# Altium schematic sheet BBoard-JX2.SchDoc: Eval Board -  BBoard JX1 connector (PWM, GPIO)
size A3; Author: O. Guinnard; Organization: imperix Ltd; Address1: Rue de l'Industrie 10; Address2: 1950 Sion; Address3: Switzerland; Address4: +41 27 552 06 60; DocumentNumber: 5; SheetNumber: 5; SheetTotal: 7
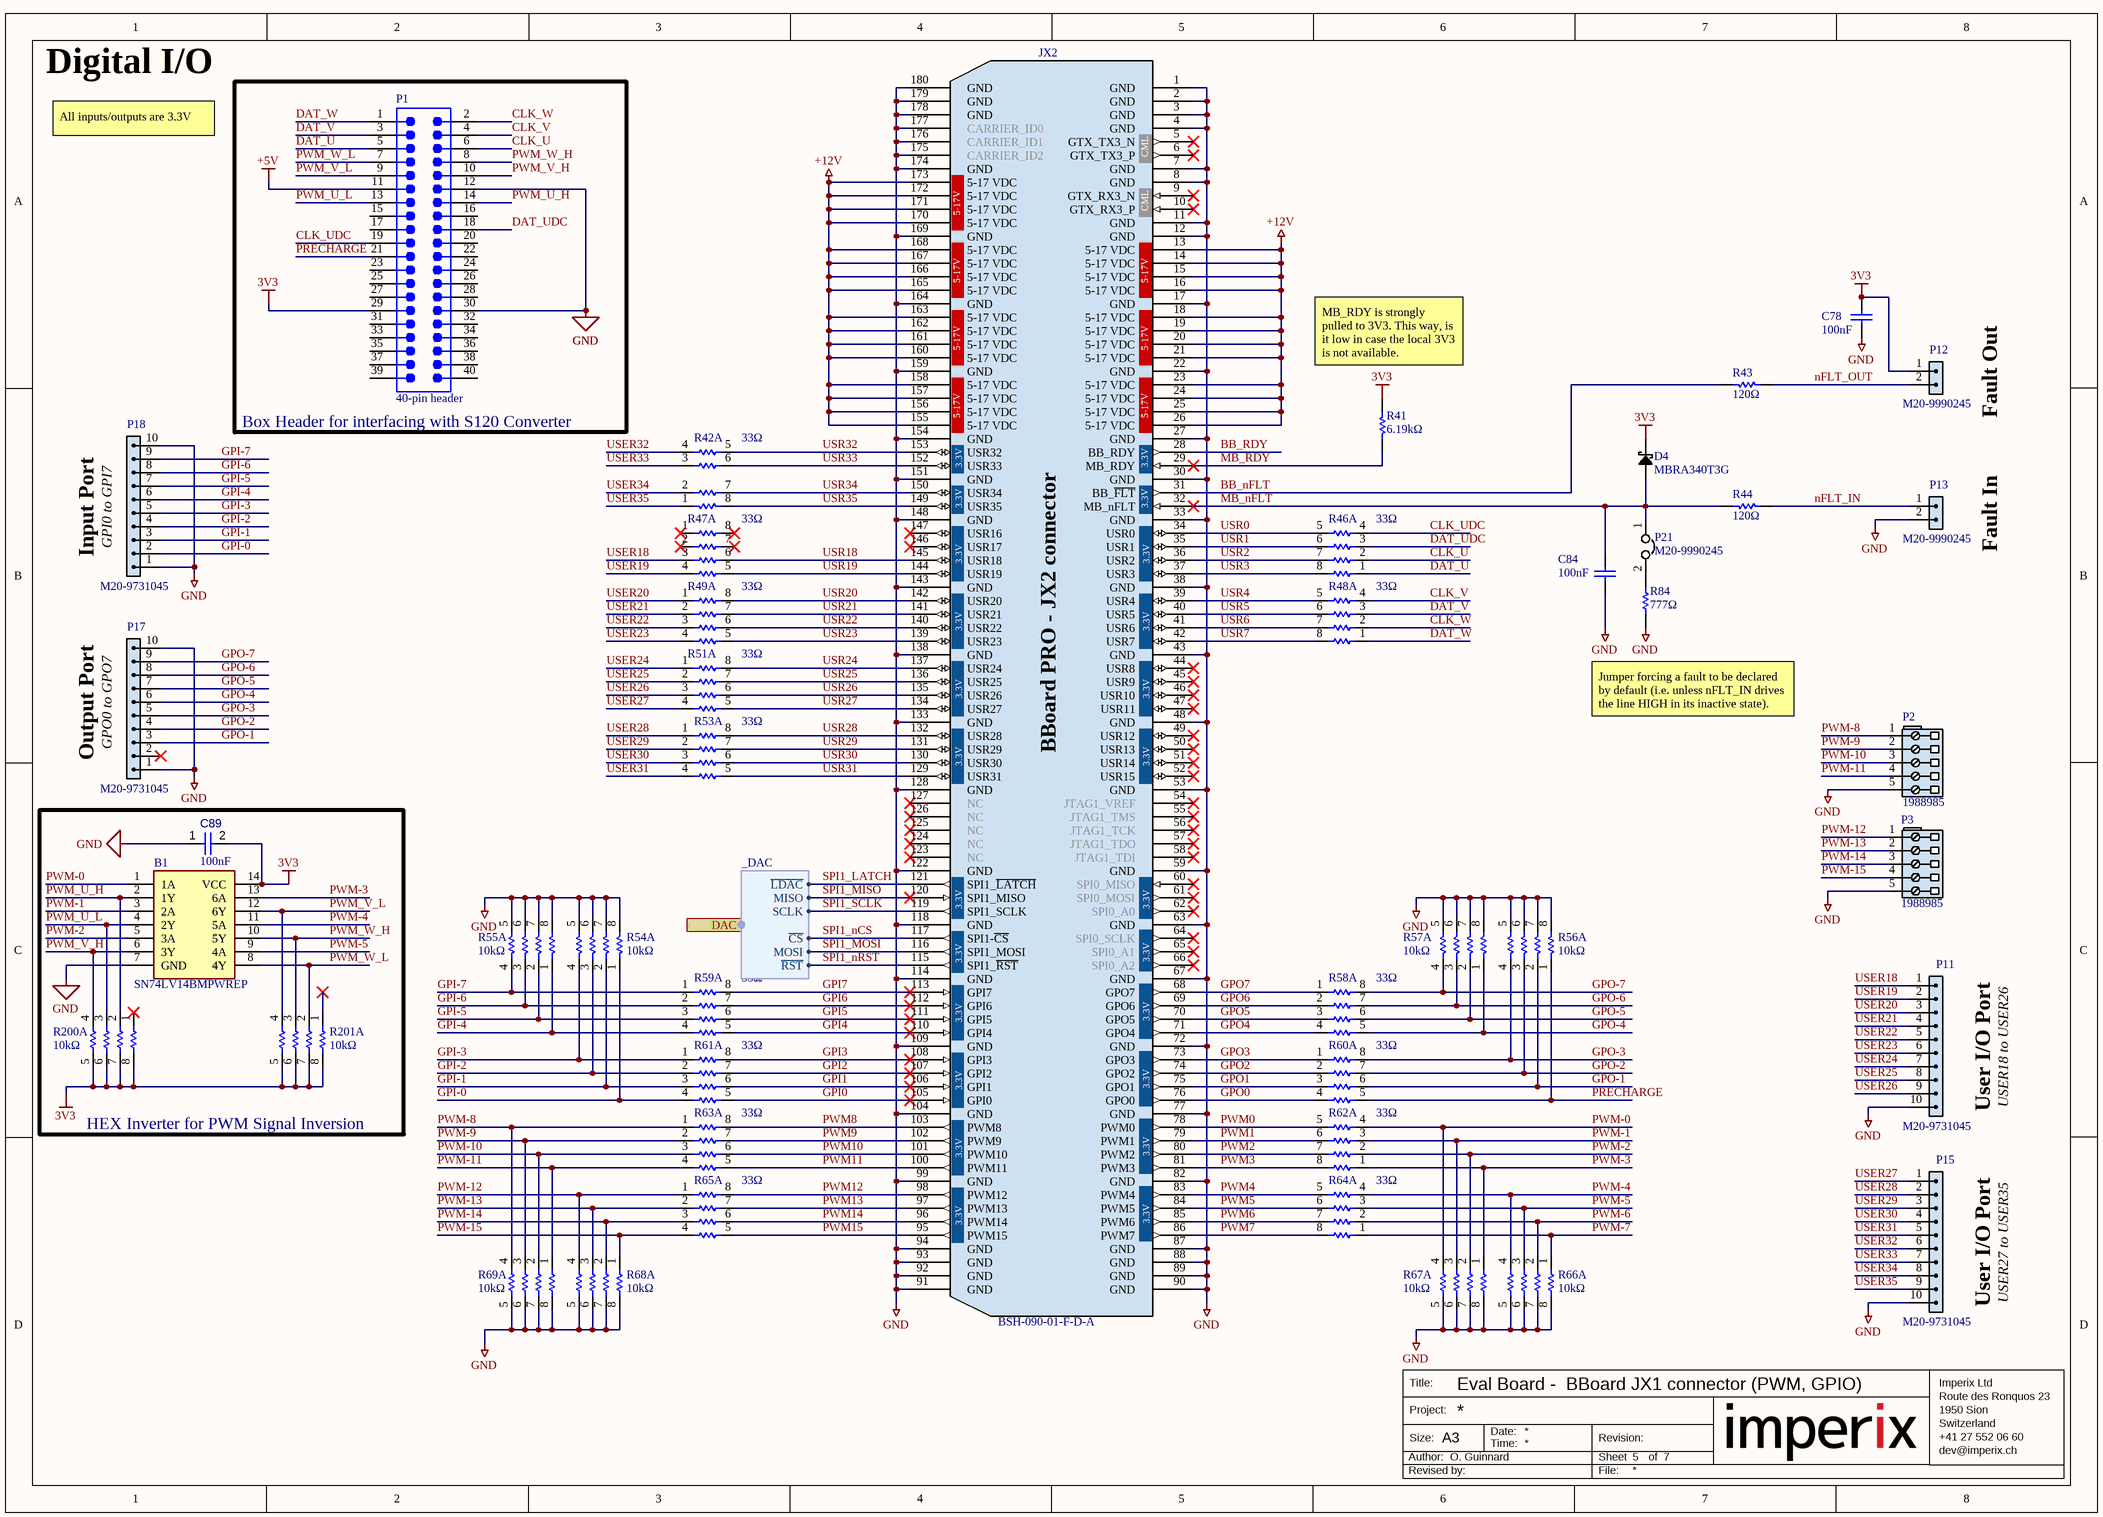
[diagram p0: BBoard-JX2.SchDoc]

## Parts
B1  SN74LV14BMPWREP  [SOP65P640X120-14N]
C78  value 100nF  [CAPC1005L(0402)]  (hidden comment: CAP-100NF-25V-X7R-0402-10%)
C84  value 100nF  [CAPC1005L(0402)]  (hidden comment: CAP-100NF-25V-X7R-0402-10%)
C89  value 100nF  [CAPC0402(1005)60_L]  (hidden comment: Capacitor 100nF +/-20% 50V 0402)
D4  MBRA340T3G  [DO-214AC]
JX2  BSH-090-01-F-D-A  [BSH-090-01-F-D-A]
P1  40-pin header  [61204021621]
P2  1988985  [1988985]
P3  1988985  [1988985]
P11  M20-9731045  [M20-9731045]
P12  M20-9990245  [M20-9990245]
P13  M20-9990245  [M20-9990245]
P15  M20-9731045  [M20-9731045]
P17  M20-9731045  [M20-9731045]
P18  M20-9731045  [M20-9731045]
P21  M20-9990245  [M20-9990245]
R41  value 6.19kΩ  [RESC1005L(0402)]  (hidden comment: RES-6.19KΩ-1/16W-100PPM-0402-1%)
R42  value 33Ω  [RESQUAD0804]  (hidden comment: EXB-28V330JX)  (parts A,B,C,D of 4)
R43  value 120Ω  [RESC1005L(0402)]  (hidden comment: RES-120Ω-1/16W-25PPM-0402-0.1%)
R44  value 120Ω  [RESC1005L(0402)]  (hidden comment: RES-120Ω-1/16W-25PPM-0402-0.1%)
R46  value 33Ω  [RESQUAD0804]  (hidden comment: EXB-28V330JX)  (parts A,B,C,D of 4)
R47  value 33Ω  [RESQUAD0804]  (hidden comment: EXB-28V330JX)  (parts A,B,C,D of 4)
R48  value 33Ω  [RESQUAD0804]  (hidden comment: EXB-28V330JX)  (parts A,B,C,D of 4)
R49  value 33Ω  [RESQUAD0804]  (hidden comment: EXB-28V330JX)  (parts A,B,C,D of 4)
R51  value 33Ω  [RESQUAD0804]  (hidden comment: EXB-28V330JX)  (parts A,B,C,D of 4)
R53  value 33Ω  [RESQUAD0804]  (hidden comment: EXB-28V330JX)  (parts A,B,C,D of 4)
R54  value 10kΩ  [RESQUAD0804]  (hidden comment: EXB-28V103JX)  (parts A,B,C,D of 4)
R55  value 10kΩ  [RESQUAD0804]  (hidden comment: EXB-28V103JX)  (parts A,B,C,D of 4)
R56  value 10kΩ  [RESQUAD0804]  (hidden comment: EXB-28V103JX)  (parts A,B,C,D of 4)
R57  value 10kΩ  [RESQUAD0804]  (hidden comment: EXB-28V103JX)  (parts A,B,C,D of 4)
R58  value 33Ω  [RESQUAD0804]  (hidden comment: EXB-28V330JX)  (parts A,B,C,D of 4)
R59  value 33Ω  [RESQUAD0804]  (hidden comment: EXB-28V330JX)  (parts A,B,C,D of 4)
R60  value 33Ω  [RESQUAD0804]  (hidden comment: EXB-28V330JX)  (parts A,B,C,D of 4)
R61  value 33Ω  [RESQUAD0804]  (hidden comment: EXB-28V330JX)  (parts A,B,C,D of 4)
R62  value 33Ω  [RESQUAD0804]  (hidden comment: EXB-28V330JX)  (parts A,B,C,D of 4)
R63  value 33Ω  [RESQUAD0804]  (hidden comment: EXB-28V330JX)  (parts A,B,C,D of 4)
R64  value 33Ω  [RESQUAD0804]  (hidden comment: EXB-28V330JX)  (parts A,B,C,D of 4)
R65  value 33Ω  [RESQUAD0804]  (hidden comment: EXB-28V330JX)  (parts A,B,C,D of 4)
R66  value 10kΩ  [RESQUAD0804]  (hidden comment: EXB-28V103JX)  (parts A,B,C,D of 4)
R67  value 10kΩ  [RESQUAD0804]  (hidden comment: EXB-28V103JX)  (parts A,B,C,D of 4)
R68  value 10kΩ  [RESQUAD0804]  (hidden comment: EXB-28V103JX)  (parts A,B,C,D of 4)
R69  value 10kΩ  [RESQUAD0804]  (hidden comment: EXB-28V103JX)  (parts A,B,C,D of 4)
R84  value 777Ω  [RESC1005L(0402)]  (hidden comment: RES-777Ω-1/16W-25PPM-0402-0.1%)
R200  value 10kΩ  [RESQUAD0804]  (hidden comment: EXB-28V103JX)  (parts A,B,C,D of 4)
R201  value 10kΩ  [RESQUAD0804]  (hidden comment: EXB-28V103JX)  (parts A,B,C,D of 4)

## Blocks framed on the sheet
Box Header for interfacing with S120 Converter: P1
HEX Inverter for PWM Signal Inversion: B1 C89 R200 R201

## Ports
DAC (harness _DAC)

## Harnesses
_DAC: MOSI, MISO, SCLK, ~{CS}, ~{LDAC}, ~{RST}

## Nets
3V3: B1.14(VCC) C78.2 C89.2 D4.K P1.29 P12.1 R41.1 R200.5 R200.6 R200.7 R200.8 R201.5 R201.6 R201.7 R201.8
+5V: P1.11
+12V: JX2.13(5-17_VDC) JX2.14(5-17_VDC) JX2.15(5-17_VDC) JX2.16(5-17_VDC) JX2.18(5-17_VDC) JX2.19(5-17_VDC) JX2.20(5-17_VDC) JX2.21(5-17_VDC) JX2.23(5-17_VDC) JX2.24(5-17_VDC) JX2.25(5-17_VDC) JX2.26(5-17_VDC) JX2.155(5-17_VDC) JX2.156(5-17_VDC) JX2.157(5-17_VDC) JX2.158(5-17_VDC) JX2.160(5-17_VDC) JX2.161(5-17_VDC) JX2.162(5-17_VDC) JX2.163(5-17_VDC) JX2.165(5-17_VDC) JX2.166(5-17_VDC) JX2.167(5-17_VDC) JX2.168(5-17_VDC) JX2.170(5-17_VDC) JX2.171(5-17_VDC) JX2.172(5-17_VDC) JX2.173(5-17_VDC)
GND: B1.7(GND) C78.1 C84.1 C89.1 JX2.1(GND) JX2.2(GND) JX2.3(GND) JX2.4(GND) JX2.7(GND) JX2.8(GND) JX2.11(GND) JX2.12(GND) JX2.17(GND) JX2.22(GND) JX2.27(GND) JX2.30(GND) JX2.33(GND) JX2.38(GND) JX2.43(GND) JX2.48(GND) JX2.53(GND) JX2.59(GND) JX2.63(GND) JX2.67(GND) JX2.72(GND) JX2.77(GND) JX2.82(GND) JX2.87(GND) JX2.88(GND) JX2.89(GND) JX2.90(GND) JX2.91(GND) JX2.92(GND) JX2.93(GND) JX2.94(GND) JX2.99(GND) JX2.104(GND) JX2.109(GND) JX2.114(GND) JX2.118(GND) JX2.122(GND) JX2.128(GND) JX2.133(GND) JX2.138(GND) JX2.143(GND) JX2.148(GND) JX2.151(GND) JX2.154(GND) JX2.159(GND) JX2.164(GND) JX2.169(GND) JX2.174(GND) JX2.175(CARRIER_ID2) JX2.176(CARRIER_ID1) JX2.177(CARRIER_ID0) JX2.178(GND) JX2.179(GND) JX2.180(GND) P1.12 P1.30 P2.5 P3.5 P11.10 P13.2 P15.10 P17.1 P17.10 P18.1 P18.10 R54.5 R54.6 R54.7 R54.8 R55.5 R55.6 R55.7 R55.8 R56.5 R56.6 R56.7 R56.8 R57.5 R57.6 R57.7 R57.8 R66.5 R66.6 R66.7 R66.8 R67.5 R67.6 R67.7 R67.8 R68.5 R68.6 R68.7 R68.8 R69.5 R69.6 R69.7 R69.8 R84.1
BB_nFLT: JX2.31(BB_~{FLT}) R43.1
BB_RDY: JX2.28(BB_RDY)
CLK_U: P1.6 R46.2
CLK_UDC: P1.19 R46.4
CLK_V: P1.4 R48.4
CLK_W: P1.2 R48.2
DAT_U: P1.5 R46.1
DAT_UDC: P1.18 R46.3
DAT_V: P1.3 R48.3
DAT_W: P1.1 R48.1
GPI0: JX2.105(GPI0) R61.5
GPI1: JX2.106(GPI1) R61.6
GPI2: JX2.107(GPI2) R61.7
GPI3: JX2.108(GPI3) R61.8
GPI4: JX2.110(GPI4) R59.5
GPI5: JX2.111(GPI5) R59.6
GPI6: JX2.112(GPI6) R59.7
GPI7: JX2.113(GPI7) R59.8
GPI-0: P18.2 R54.1 R61.4
GPI-1: P18.3 R54.2 R61.3
GPI-2: P18.4 R54.3 R61.2
GPI-3: P18.5 R54.4 R61.1
GPI-4: P18.6 R55.1 R59.4
GPI-5: P18.7 R55.2 R59.3
GPI-6: P18.8 R55.3 R59.2
GPI-7: P18.9 R55.4 R59.1
GPO0: JX2.76(GPO0) R60.4
GPO1: JX2.75(GPO1) R60.3
GPO2: JX2.74(GPO2) R60.2
GPO3: JX2.73(GPO3) R60.1
GPO4: JX2.71(GPO4) R58.4
GPO5: JX2.70(GPO5) R58.3
GPO6: JX2.69(GPO6) R58.2
GPO7: JX2.68(GPO7) R58.1
GPO-1: P17.3 R56.2 R60.6
GPO-2: P17.4 R56.3 R60.7
GPO-3: P17.5 R56.4 R60.8
GPO-4: P17.6 R57.1 R58.5
GPO-5: P17.7 R57.2 R58.6
GPO-6: P17.8 R57.3 R58.7
GPO-7: P17.9 R57.4 R58.8
MB_nFLT: C84.2 D4.A JX2.32(MB_nFLT) P21.1 R44.1
MB_RDY: JX2.29(MB_RDY) R41.2
nFLT_IN: P13.1 R44.2
nFLT_OUT: P12.2 R43.2
PRECHARGE: P1.21 R56.1 R60.5
PWM0: JX2.78(PWM0) R62.5
PWM1: JX2.79(PWM1) R62.6
PWM2: JX2.80(PWM2) R62.7
PWM3: JX2.81(PWM3) R62.8
PWM4: JX2.83(PWM4) R64.5
PWM5: JX2.84(PWM5) R64.6
PWM6: JX2.85(PWM6) R64.7
PWM7: JX2.86(PWM7) R64.8
PWM8: JX2.103(PWM8) R63.8
PWM9: JX2.102(PWM9) R63.7
PWM10: JX2.101(PWM10) R63.6
PWM11: JX2.100(PWM11) R63.5
PWM12: JX2.98(PWM12) R65.8
PWM13: JX2.97(PWM13) R65.7
PWM14: JX2.96(PWM14) R65.6
PWM15: JX2.95(PWM15) R65.5
PWM-0: B1.1(1A) R62.4 R67.4
PWM-1: B1.3(2A) R62.3 R67.3
PWM-2: B1.5(3A) R62.2 R67.2
PWM-3: B1.13(6A) R62.1 R67.1
PWM-4: B1.11(5A) R64.4 R66.4
PWM-5: B1.9(4A) R64.3 R66.3
PWM-6: R64.2 R66.2
PWM-7: R64.1 R66.1
PWM-8: P2.1 R63.1 R69.4
PWM-9: P2.2 R63.2 R69.3
PWM-10: P2.3 R63.3 R69.2
PWM-11: P2.4 R63.4 R69.1
PWM-12: P3.1 R65.1 R68.4
PWM-13: P3.2 R65.2 R68.3
PWM-14: P3.3 R65.3 R68.2
PWM-15: P3.4 R65.4 R68.1
PWM_U_H: B1.2(1Y) P1.14 R200.2
PWM_U_L: B1.4(2Y) P1.13 R200.3
PWM_V_H: B1.6(3Y) P1.10 R200.4
PWM_V_L: B1.12(6Y) P1.9 R201.4
PWM_W_H: B1.10(5Y) P1.8 R201.3
PWM_W_L: B1.8(4Y) P1.7 R201.2
SPI1_LATCH: JX2.121(SPI1_~{LATCH}) ; port DAC.~{LDAC}
SPI1_MISO: JX2.120(SPI1_MISO) ; port DAC.MISO
SPI1_MOSI: JX2.116(SPI1_MOSI) ; port DAC.MOSI
SPI1_nCS: JX2.117(SPI1-~{CS}) ; port DAC.~{CS}
SPI1_nRST: JX2.115(SPI1_~{RST}) ; port DAC.~{RST}
SPI1_SCLK: JX2.119(SPI1_SCLK) ; port DAC.SCLK
USER18: P11.1 R47.3
USER19: P11.2 R47.4
USER20: P11.3 R49.1
USER21: P11.4 R49.2
USER22: P11.5 R49.3
USER23: P11.6 R49.4
USER24: P11.7 R51.1
USER25: P11.8 R51.2
USER26: P11.9 R51.3
USER27: P15.1 R51.4
USER28: P15.2 R53.1
USER29: P15.3 R53.2
USER30: P15.4 R53.3
USER31: P15.5 R53.4
USER32: P15.6 R42.4
USER33: P15.7 R42.3
USER34: P15.8 R42.2
USER35: P15.9 R42.1
USR0: JX2.34(USR0) R46.5
USR1: JX2.35(USR1) R46.6
USR2: JX2.36(USR2) R46.7
USR3: JX2.37(USR3) R46.8
USR4: JX2.39(USR4) R48.5
USR5: JX2.40(USR5) R48.6
USR6: JX2.41(USR6) R48.7
USR7: JX2.42(USR7) R48.8
USR18: JX2.145(USR18) R47.6
USR19: JX2.144(USR19) R47.5
USR20: JX2.142(USR20) R49.8
USR21: JX2.141(USR21) R49.7
USR22: JX2.140(USR22) R49.6
USR23: JX2.139(USR23) R49.5
USR24: JX2.137(USR24) R51.8
USR25: JX2.136(USR25) R51.7
USR26: JX2.135(USR26) R51.6
USR27: JX2.134(USR27) R51.5
USR28: JX2.132(USR28) R53.8
USR29: JX2.131(USR29) R53.7
USR30: JX2.130(USR30) R53.6
USR31: JX2.129(USR31) R53.5
USR32: JX2.153(USR32) R42.5
USR33: JX2.152(USR33) R42.6
USR34: JX2.150(USR34) R42.7
USR35: JX2.149(USR35) R42.8
NetP21_2: P21.2 R84.2

Not connected (* = marked no-connect by the designer): JX2 5(GTX_TX3_N)* 6(GTX_TX3_P)* 9(GTX_RX3_N)* 10(GTX_RX3_P)* 44(USR8)* 45(USR9)* 46(USR10)* 47(USR11)* 49(USR12)* 50(USR13)* 51(USR14)* 52(USR15)* 54(JTAG1_VREF)* 55(JTAG1_TMS)* 56(JTAG1_TCK)* 57(JTAG1_TDO)* 58(JTAG1_TDI)* 60(SPI0_MISO)* 61(SPI0_MOSI)* 62(SPI0_A0)* 64(SPI0_SCLK)* 65(SPI0_A1)* 66(SPI0_A2)* 123(NC)* 124(NC)* 125(NC)* 126(NC)* 127(NC)* 146(USR17)* 147(USR16)*; P1 15 16 17 20 22 23 24 25 26 27 28 31 32 33 34 35 36 37 38 39 40; P17 2*; R47 1* 2* 7* 8*; R200 1*; R201 1*

## Notes on the sheet
- Digital I/O
- All inputs/outputs are 3.3V
- (near R41) MB_RDY is strongly pulled to 3V3. This way, is it low in case the local 3V3 is not available.
- (near P12) Fault Out
- (near P18) Input Port
- (near P18) GPI0 to GPI7
- (near P13) Fault In
- (near P17) Output Port
- (near P17) GPO0 to GPO7
- (near R84) Jumper forcing a fault to be declared by default (i.e. unless nFLT_IN drives the line HIGH in its inactive state).
- (near P11) User I/O Port
- USER18 to USER26
- (near P15) User I/O Port
- USER27 to USER35
- Title:
- Imperix Ltd
- Route des Ronquos 23
- Author:
- Project:
- Size:
- A3
- Date:
- Time:
- Revision:
- Sheet
- of
- 1950 Sion
- Switzerland
- +41 27 552 06 60
- dev@imperix.ch
- Revised by:
- File:
- (in symbol CMP-070-000034-11) CML; 5-17V; 3.3V; BBoard PRO - JX2 connector

## Library data of the parts
B1 = SN74LV14BMPWREP: Buffers & Line Drivers Enhanced product six-channel 2-V to 5.5-V inverters with Schmitt-Trigger inputs 14-TSSOP -55 to 125; Manufacturer_Name: Texas Instruments; Geometry.Height: 1.2mm; Manufacturer_Part_Number: SN74LV14BMPWREP; Mouser Part Number: 595-SN74LV14BMPWREP; Mouser Price/Stock: https://www.mouser.co.uk/ProductDetail/Texas-Instruments/SN74LV14BMPWREP?qs=HoCaDK9Nz5fSnWYSOigIVw%3D%3D; Arrow Part Number: *; Arrow Price/Stock: *; Datasheet Link: https://www.ti.com/lit/ds/symlink/sn74lv14b-ep.pdf?ts=1721665849773&ref_url=https%253A%252F%252Fwww.ti.com%252Fproduct%252FSN74LV14B-EP%253Fbm-verify%253DAAQAAAAJ_____xCRxVYzN0ZP5KnI32M898cdzk_vVBOKhwrKmXlj3-P_3M_Mnh5G3rD7WBG7EyrGOmmHo91Qgihl-F3Dqbjb4gK-S
C78 C84 = CMP-004-000006-18: CAP CER 100NF 25V X7R 0402 10% (Generic Imperix Component); Tolerance: 10%; Case/Package: 0402; Dielectric: X7R; Voltage Rating (DC): 25V
C89 = CMP-001-00067-3: Chip Capacitor, 100nF +/-20%, 50V, 0402, Thickness 0.6 mm; Tolerance: 10%; Min Operating Temperature: -55°C; Pins: 2; Case/Package: 0402; Max Operating Temperature: 85°C; Voltage Rating: 50V; Mounting Technology: SMT
D4 = CMP-005-000028-6: Diode Schottky 40 V 3A Surface Mount SMA; Max Forward Surge Current (Ifsm): 100A; Max Repetitive Reverse Voltage (Vrrm): 40V; Polarity: Standard; Element Configuration: Single; Forward Voltage: 450mV; Max Reverse Current: 300uA; Max Operating Temperature: 150°C; Radiation Hardening: No; Length: 4.32mm; Reach SVHC Compliant: No; Pins: 2; Package Quantity: 1; Voltage Rating (DC): 40V; RoHS Compliant: Yes; Halogen Free: Halogen Free; Series: -; Current Rating: 3A; Case/Package: DO-214AC; Height: 2mm; Min Operating Temperature: -55°C; Lead Free: Lead Free; Peak Non-Repetitive Surge Current: 100A; Max Reverse Voltage (DC): 40V; Output Current: 3A; Width: 2.6mm; Packaging: Tape and Reel; Forward Current: 3A; Average Rectified Current: 3A
JX2 = CMP-070-000034-11: JX2 for BBoard; Max Current Rating: 1.25A; Number of Positions: 180; Max Voltage Rating (AC): 125V; Gender: Female; Mated Stacking Heights: 5mm; Pitch: 0.5mm; Contact Plating: Gold; Length: 51.27mm; Max Operating Temperature: 125°C; Depth: 7.24mm; Series: BSH; Mounting Technology: Surface Mount; Radiation Hardening: No; Orientation: Straight; Packaging: Bulk; Min Operating Temperature: -55°C; Termination: Solder; Number of Rows: 2; Contact Material: Bronze; Housing Material: Polymer; Height: 3.25mm; Number of Contacts: 180; RoHS Compliant: Yes
P1 = CMP-1502-00015-3: Würth WR-BHD Male Box Header; NexarPartId: 25903616; Row Spacing: 2.54mm; Connector Type: Male Pin; Current Rating: 3A; Number of Positions: 40; Voltage Rating: 250V; Insulation Resistance: 1GΩ; Contact Resistance: 20mΩ; Gender: Male; RoHS: Compliant; Color: Black; Pitch: 2.54mm; Orientation: Vertical; Contact Plating: Gold; Lead Pitch: 2.54mm; REACH SVHC: Unknown; Termination: Solder; Max Operating Temperature: 105°C; Insulation Material: PBT; Number of Rows: 2; Min Operating Temperature: -40°C; Number of Pins: 40; Mount: Through Hole; Contact Material: Copper; Number of Contacts: 40; Height: 9.25mm; Length: 58.46mm; Operating Supply Voltage: 250V; Manufacturer: Würth; Manufacturer Part Number: 61204021621; Distributor Link: https://www.digikey.de/de/products/detail/w%C3%BCrth-elektronik/61204021621/4846944?utm_adgroup=&utm_source=google&utm_medium=cpc&utm_campaign=PMax:%20Smart%20Shopping_Product_Zombie%20SKUs&utm_term=&productid=4846944&utm_content=&utm_id=go_cmp-18521752285_adg-_ad-__dev-c_ext-_prd-4846944_sig-CjwKCAjwk8e1BhALEiwAc8MHiPu65UqwhcTUhc3Oy_D4OxhjwtwX-0sQuaE496hG5TY3wiiykcjkwRoCKKMQAvD_BwE&gad_source=1&gclid=CjwKCAjwk8e1BhALEiwAc8MHiPu65UqwhcTUhc3Oy_D4OxhjwtwX-0sQuaE496hG5TY3wiiykcjkwRoCKKMQAvD_BwE
P2 P3 = CMP-003-000046-13: Conn PC Terminal Block 5 POS 3.5mm Solder Thru-Hole 17.5A; Number of Poles: 5; Voltage: 300V; Current: 10A; Approvals: UL,EAC; Number of Levels: 1; Wire Gauge (Max): 26AWG; Gender: Male; Wire Gauge (Min): 16AWG; Voltage Rating: 160V; Number of Rows: 1; Mounting Technology: Through Hole; Lead Free: Lead Free; Color: Green; Number of Positions: 5; Orientation: Straight; Weight: 0.086068oz; Max Current Rating: 17.5A; Number of Circuits: 5; Number of Positions Per Level: 5; Packaging: Bulk; Pitch: 3.5mm; Current Rating: 17.5A; Material: Polyamide; Series: COMBICON PTA; Length: 11.2mm; Pins: 5; Height: 13.7mm; Housing Material: Nylon; Number of Contacts: 5; Contact Material: Tin; RoHS Compliant: Yes; Width: 17.5mm; Depth: 9.9mm; Housing Color: Green; Package Quantity: 100; Termination: Screw; Flammability Rating: UL94 V-0
P11 P15 P17 P18 = CMP-003-000044-17: Connector Header Through Hole 10 position 0.100" (2.54mm); Mated Stacking Heights: 16.54mm; Current Rating: 3A; Number of Positions: 10; Voltage Rating: 750V; Gender: Male; Pitch: 2.54mm; Contact Shape: Square; Housing Material: Nylon; Max Operating Temperature: 105°C; Contact Plating: Gold; Termination: Solder; Contact Material: Brass; Contact Type: Male Pin; Contact Finish - Mating: GOLD; Packaging: Bulk; Number of Rows: 1; Insulation Material: Nylon; Radiation Hardening: No; Flammability Rating: UL94 V-0; Fastening Type: Pull; Min Operating Temperature: -40°C; Number of Contacts: 10; Package Quantity: 500; Insulation Color: Black; RoHS Compliant: Yes; Series: M20; Mounting Technology: Through Hole
P12 P13 = CMP-003-000045-14: Connector Header Through Hole 2 position 0.100" (2.54mm); Working Voltage: 750V; Gender: Male; Number of Positions: 2; Insulation Resistance: 10GR; Contact Resistance: 25mR; Mated Stacking Heights: 16.54mm; Current Rating: 3A; Mating Cycles: 300; Voltage: 50V; Housing Color: Black; Reach SVHC Compliant: No; Packaging: Bulk; Radiation Hardening: No; Min Operating Temperature: -40°C; Package Quantity: 1000; Series: M20; Housing Material: Nylon; Contact Finish - Mating: GOLD; Contact Material: Brass,Bronze; Length: 5.08mm; Max Current Rating: 3A; Current: 3A; Flammability Rating: UL94 V-0; Fastening Type: Pull; Depth: 2.54mm; Orientation: Straight; Contact Type: Male Pin; Number of Rows: 1; Number of Poles: 2; Voltage Rating (DC): 750V; Lead Pitch: 2.54mm; Mounting Technology: Through Hole; Contact Plating: Gold; Max Operating Temperature: 105°C; Voltage Rating (AC): 750V; Termination: Solder; Insulation Color: Black; Number of Contacts: 2; Contact Shape: Square; Pitch: 2.54mm; Insulation Material: Nylon
P21 = CMP-070-000025-6: Connector Header Through Hole 2 position 0.100" (2.54mm); Max Current Rating: 3A; Voltage Rating (AC): 750V; Number of Contacts: 2; Contact Resistance: 25mR; Gender: Male; Insulation Resistance: 10GR; Mating Cycles: 300; Mated Stacking Heights: 16.54mm; Voltage: 50V; Packaging: Bulk; Min Operating Temperature: -40°C; Series: M20; Contact Material: Brass,Bronze; Number of Rows: 1; Housing Material: Nylon; Housing Color: Black; Termination: Solder; Contact Plating: Gold; Mounting Technology: Through Hole; Contact Type: Male Pin; Pitch: 2.54mm; Number of Positions: 2; Max Operating Temperature: 105°C; Reach SVHC Compliant: No; Length: 5.08mm; Radiation Hardening: No; Current Rating: 3A; Package Quantity: 1000; Orientation: Straight; Depth: 2.54mm; Fastening Type: Pull; Insulation Color: Black; Flammability Rating: UL94 V-0; Lead Pitch: 2.54mm; Insulation Material: Nylon; Contact Finish - Mating: GOLD; Current: 3A; Voltage Rating (DC): 750V; Number of Poles: 2; Contact Shape: Square; Working Voltage: 750V
R41 = CMP-009-000034-6: RES SMD 6.19KΩ 1/16W 100PPM 0402 1% (Generic Imperix Component); Temperature Coefficient: 100ppm/°C; Tolerance: 1%; Power Rating: 1/16W; Case/Package: 0402
R42 R46-R49 R51 R53 R58-R65 = CMP-009-000035-3: Res Thick Film Array 33 Ohm 5% ±200ppm/°C ISOL 8-Pin 0804(4 X 0402) Convex SMD Automotive T/R; Power Rating: 62.5mW; Voltage Rating (DC): 100V; Circuit Type: Isolated; Power Dissipation: 63mW; Number of Elements: 4; Number of Contacts: 8; Voltage Rating: 50V; Tolerance: 5%; Pins: 8; Resistance Tolerance: 5%; Series: EXB; Min Operating Temperature: -55°C; Height: 0.35mm; Temperature Coefficient: 200ppm/°C; Length: 2mm; Package Quantity: 10000; Width: 1mm; Reach SVHC Compliant: No; Power Per Element: 62.5mW; Technology: THICK FILM; Termination: Convex; RoHS Compliant: Yes; Packaging: Tape and Reel; Case Code (Metric): 1005; Max Operating Temperature: 125°C; Lead Free: Lead Free; Case/Package: 0804; Mounting Technology: Surface Mount; Radiation Hardening: No; Military Standard: Not; Number of Resistors: 4; Depth: 1mm; Case Code (Imperial): 0402; Terminal Pitch: 0.5mm
R43 R44 = CMP-017-000008-4: RES SMD 120Ω 1/16W 25PPM 0402 0.1% (Generic Imperix Component); Temperature Coefficient: 25ppm/°C; Tolerance: 0.1%; Power Rating: 1/16W; Case/Package: 0402
R54-R57 R66-R69 R200 R201 = CMP-062-000000-4: Res Thick Film Array 10KΩ 5% ±200ppm/°C ISOL 8-Pin 0804(4 X 0402) Convex SMD Automotive T/R; Circuit Type: Isolated; Number of Contacts: 8; Number of Elements: 4; Power Dissipation: 63mW; Power Per Element: 62.5mW; Voltage Rating (DC): 100V; Voltage Rating: 50V; Tolerance: 5%; Case/Package: 0804; Case Code (Imperial): 0402; Case Code (Metric): 1005; Depth: 1mm; Height: 0.35mm; Lead Free: Lead Free; Length: 2mm; Max Operating Temperature: 125°C; Military Standard: Not; Min Operating Temperature: -55°C; Mounting Technology: Surface Mount; Number of Resistors: 4; Package Quantity: 1; Packaging: Tape and Reel; Pins: 8; Power Rating: 62.5mW; Radiation Hardening: No; Reach SVHC Compliant: Unknown; Resistance Tolerance: 5%; RoHS Compliant: Yes; Series: EXB; Technology: THICK FILM; Temperature Coefficient: 200ppm/°C; Terminal Pitch: 0.5mm; Termination: Convex; Width: 1mm
R84 = CMP-150-000004-2: RES SMD 777Ω 1/16W 25PPM 0402 0.1% (Generic Imperix Component); Temperature Coefficient: 25ppm/°C; Power Rating: 1/16W; Tolerance: 0.1%; Case/Package: 0402